# Altium schematic sheet Regulators.SchDoc
size A4; DocumentNumber: 7; SheetNumber: 7; SheetTotal: 10
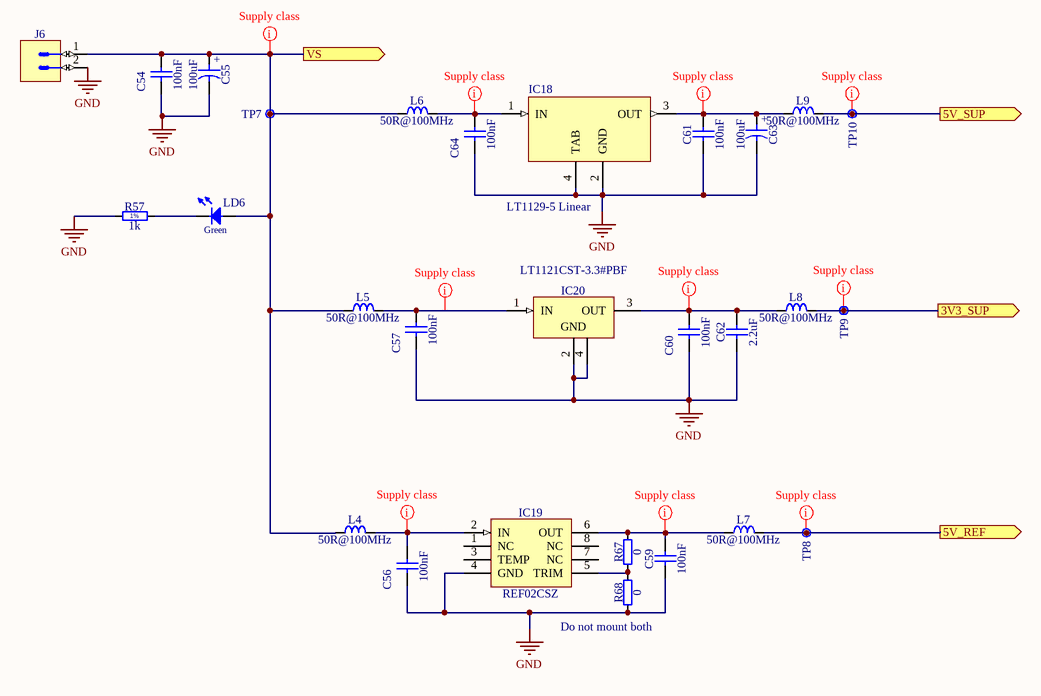
[diagram p0: Regulators.SchDoc]

## Parts
C54  100nF  [CAPC2012X135N]
C55  100uF  [CAPAE660X540N]
C56  100nF  [CAPC2012X135N]
C57  100nF  [CAPC2012X135N]
C59  100nF  [CAPC2012X135N]
C60  100nF  [CAPC2012X135N]
C61  100nF  [CAPC2012X135N]
C62  2.2uF  [CAPC2012X135N]
C63  100uF  [CAPAE660X540N]
C64  100nF  [CAPC2012X135N]
IC18  LT1129-5 Linear  [SOT230P700X175-4N]
IC19  REF02CSZ  [SOIC127P600X175-8N]
IC20  LT1121CST-3.3#PBF  [SOT230P700X180-4N]
J6  MATE-N-LOK  [TYCO_350786-1]  (value not drawn)
L4  50R@100MHz  [IND_MURATA_BLM31PG]
L5  50R@100MHz  [IND_MURATA_BLM31PG]
L6  50R@100MHz  [IND_MURATA_BLM31PG]
L7  50R@100MHz  [IND_MURATA_BLM31PG]
L8  50R@100MHz  [IND_MURATA_BLM31PG]
L9  50R@100MHz  [IND_MURATA_BLM31PG]
LD6  Green  [LED_OSRAM_LGR971]  (value not drawn)
R57  1k  [RESC2012X60N]
R67  0  [RESC2012X60N]
R68  0  [RESC2012X60N]
TP7  Test Point  [VERO_20-2136]  (value not drawn)
TP8  Test Point  [VERO_20-2136]  (value not drawn)
TP9  Test Point  [VERO_20-2136]  (value not drawn)
TP10  Test Point  [VERO_20-2136]  (value not drawn)

## Ports
3V3_SUP (out), 5V_REF (out), 5V_SUP (out), VS (out)

## Nets
GND: C54.1 C55.2 C56.1 C57.1 C59.1 C60.1 C61.1 C62.1 C63.2 C64.1 IC18.2(GND) IC18.4(TAB) IC19.4(GND) IC20.2(GND) IC20.4(GND) J6.2 R57.1 R68.1
3V3_SUP: L8.2 TP9.1 ; port 3V3_SUP
5V_REF: L7.2 TP8.1 ; port 5V_REF
5V_SUP: L9.2 TP10.1 ; port 5V_SUP
VS: C54.2 C55.1 J6.1 L4.1 L5.1 L6.1 LD6.2(A) TP7.1 ; port VS
NetC56_2: C56.2 IC19.2(IN) L4.2
NetC57_2: C57.2 IC20.1(IN) L5.2
NetC59_2: C59.2 IC19.6(OUT) L7.1 R67.2
NetC60_2: C60.2 C62.2 IC20.3(OUT) L8.1
NetC61_2: C61.2 C63.1 IC18.3(OUT) L9.1
NetC64_2: C64.2 IC18.1(IN) L6.2
NetIC19_5: IC19.5(TRIM) R67.1 R68.2
NetLD6_1: LD6.1(C) R57.2

Not connected (* = marked no-connect by the designer): IC19 1(NC) 3(TEMP) 7(NC) 8(NC)

## Layout directives
net class Supply: 3V3_SUP, 5V_REF, 5V_SUP, NetC56_2, NetC57_2, NetC59_2, NetC60_2, NetC61_2, NetC64_2, VS

## Notes on the sheet
- (near R68) Do not mount both
- (in symbol CAE660-540_100UF_16V_20%) +
- (in symbol R0805_1K_1%_0.125W_100PPM) 1%

## Library data of the parts
C54 C56 C57 C59-C61 C64 = CC0805_100NF_50V_10%_X7R: Non-polarised capacitor; Part Description: SMD Multilayer Chip Ceramic Capacitor; Manufacturer: GENERIC; Manufacturer1 Part Number: C2012X7R1H104K085AA; Voltage: 50V; TC: X7R; Tolerance: ±10%; Part Number: CC0805_100NF_50V_10%_X7R; Component Kind: Standard; Component Type: Standard; Pin Count: 2; Value: 100nF; Status: Preferred; Manufacturer Part Number: CC0805_100NF_50V_10%_X7R; Case: 0805; Mounted: Yes; Socket: No; SMD: Yes; Sense: No; Manufacturer1 Example: TDK; Manufacturer1 ComponentHeight: 1mm; HelpURL: \\cern.ch\dfs\Applications\Altium\Datasheets\CC0805_X7R_TDK_C.pdf; Author: CERN DEM JLC; CreateDate: 03.12.2007; LatestRevisionDate: 22.04.2015
C55 C63 = CAE660-540_100UF_16V_20%: Polarised capacitor; Part Description: Aluminum Electrolytic SMT Capacitor; Manufacturer: PANASONIC; Manufacturer Part Number: EEEFK1C101AP; Voltage: 16V; Tolerance: ±20%; Part Number: CAE660-540_100UF_16V_20%; Component Kind: Standard; Component Type: Standard; Pin Count: 2; Value: 100uF; Status: Not Recommended; Case: D; Mounted: Yes; Socket: No; SMD: Yes; Sense: No; ComponentHeight: 5.8mm; HelpURL: \\cern.ch\dfs\Applications\Altium\Datasheets\CAE_PANASONIC_FK.pdf; Author: CERN DEM JLC; CreateDate: 03.12.2007; LatestRevisionDate: 05.11.2014
C62 = CC0805_2.2UF_16V_10%_X7R: Non-polarised capacitor; Part Description: SMD Multilayer Chip Ceramic Capacitor; Manufacturer: GENERIC; Manufacturer1 Part Number: GRM21BF51C225ZA01L; Voltage: 16V; TC: X7R; Tolerance: ±10%; Part Number: CC0805_2.2UF_16V_10%_X7R; Component Kind: Standard; Component Type: Standard; Pin Count: 2; Value: 2.2uF; Status: Preferred; Manufacturer Part Number: CC0805_2.2UF_16V_10%_X7R; Case: 0805; Mounted: Yes; Socket: No; SMD: Yes; Sense: No; Manufacturer1 Example: MURATA; Manufacturer1 ComponentHeight: 1.5mm; HelpURL: \\cern.ch\dfs\Applications\Altium\Datasheets\CC0805_X7R_MURATA_GRM.pdf; Author: CERN DEM JLC; CreateDate: 03.12.2007; LatestRevisionDate: 18.09.2014
IC18 = LT1129-5: Name: LT1129-5; Manufacturer: Linear
IC19 = REF02CSZ: Precision Voltage Reference/Temperature Transducer; Part Description: 5V Precision Voltage Reference/Temperature Transducer; Manufacturer: ANALOG DEVICES; PressFit: No; Bonding: No; Part Number: REF02CSZ; Component Kind: Standard; Component Type: Standard; Device: REF02CSZ; PackageDescription: SOIC 8, Pitch 1.27mm, Body 4x5mm, IPC Medium Density; Manufacturer Part Number: REF02CSZ; Pin Count: 8; Case: SOIC8; Mounted: Yes; Socket: No; SMD: Yes; Sense: No; ComponentHeight: 1.75mm; HelpURL: \\cern.ch\dfs\Applications\Altium\Datasheets\REF02CSZ.pdf; Author: CERN DEM JLC; CreateDate: 29.05.2008; LatestRevisionDate: 29.05.2008
IC20 = LT1121CST-3.3#PBF: 3-Terminal Regulator 1=IN 2=GND 3=OUT 4=GND; Part Description: 3.3V, 150mA Micropower Low-Dropout Regulator; Manufacturer: LINEAR TECHNOLOGY; PressFit: No; Bonding: No; Part Number: LT1121CST-3.3#PBF; Component Kind: Standard; Component Type: Standard; Device: LT1121CST-3.3#PBF; PackageDescription: SOT223, 2.30mm pitch; 3 pin, 3.70mm W X 6.70mm L, IPC Medium Density; Manufacturer Part Number: LT1121CST-3.3#PBF; Pin Count: 4; Case: SOT223; Mounted: Yes; Socket: No; SMD: Yes; Sense: No; ComponentHeight: 1.8mm; HelpURL: \\cern.ch\dfs\Applications\Altium\Datasheets\LT1121CST-3.3#PBF.pdf; Author: CERN DEM JLC; CreateDate: 24.06.2014; LatestRevisionDate: 24.06.2014
J6 = TYCO_350786-1: Connector 2 Male; Part Description: 2 Circuits In-Line - Universal MATE-N-LOK Connector; Manufacturer: TYCO ELECTRONICS; PressFit: No; Part Number: TYCO_350786-1; Component Kind: Standard; Component Type: Standard; Pin Count: 2; Family: MATE-N-LOK; Mounted: Yes; Socket: No; SMD: No; Sense: No; Status: None; Manufacturer Part Number: 350786-1; ComponentHeight: 14.73mm; HelpURL: \\cern.ch\dfs\Applications\Altium\Datasheets\TYCO_350786-1.pdf; Author: CERN DEM JMW; CreateDate: 04.06.2008; LatestRevisionDate: 04.06.2008
L4-L9 = IND1206_MURATA_BLM31PG500SN1: Inductor; Part Description: SMD EMIFIL Chip Ferrite Bead; Manufacturer: MURATA; Power: 3.5A; Resistance: 0.015R; Part Number: IND1206_MURATA_BLM31PG500SN1; Component Kind: Standard; Component Type: Standard; Pin Count: 2; Value: 50R@100MHz; Status: None; Manufacturer Part Number: BLM31PG500SN1; Case: 1206; Mounted: Yes; Socket: No; SMD: Yes; Sense: No; ComponentHeight: 1.3mm; HelpURL: \\cern.ch\dfs\Applications\Altium\Datasheets\IND1206_MURATA_BLM31P.pdf; Author: CERN DEM JLC; CreateDate: 05.12.2013; LatestRevisionDate: 05.12.2013
LD6 = LED_OSRAM_LGR971: LED Green 1C 2A; Part Description: Surface Mount Green LED (0805 Case); Manufacturer: OSRAM; Manufacturer Part Number: LGR971; PressFit: No; Bonding: No; Part Number: LED_OSRAM_LGR971; Component Kind: Standard; Component Type: Standard; Color: Green; PackageDescription: Green Chip LED, 2-Leads, Body 2.0x1.25mm, IPC Medium Density; Pin Count: 2; Case: 0805; Mounted: Yes; Socket: No; SMD: Yes; Sense: No; ComponentHeight: 0.9mm; HelpURL: \\cern.ch\dfs\Applications\Altium\Datasheets\LED_OSRAM_LGR971.pdf; Author: CERN DEM JLC; CreateDate: 28.01.2009; LatestRevisionDate: 17.03.2010
R57 = R0805_1K_1%_0.125W_100PPM: Resistor - 1%; Part Description: General Purpose Thick Film Chip Resistor; Manufacturer: GENERIC; Manufacturer1 Part Number: NRC10F1001TRF; Power: 0.125W; TC: ±100ppm/°C; PressFit: No; Part Number: R0805_1K_1%_0.125W_100PPM; Component Kind: Standard; Component Type: Standard; Pin Count: 2; Value: 1k; Status: Preferred; Tolerance: ±1%; Manufacturer Part Number: R0805_1K_1%_0.125W_100PPM; Case: 0805; Mounted: Yes; Sense: No; Socket: No; SMD: Yes; Manufacturer1 Example: NIC COMPONENT; Manufacturer1 ComponentHeight: 0.6mm; HelpURL: \\cern.ch\dfs\Applications\Altium\Datasheets\R0805_NIC_NRC.pdf; Author: CERN DEM JLC; CreateDate: 03.12.2007; LatestRevisionDate: 13.03.2008
R67 R68 = R0805_0R_JUMPER: Resistor; Part Description: 2A (0.05R Max DC Resistance) Zero Ohm Jumper; Manufacturer: GENERIC; Manufacturer1 Part Number: NRC10Z0; PressFit: No; Part Number: R0805_0R_JUMPER; Component Kind: Standard; Component Type: Standard; Pin Count: 2; Value: 0; Status: Preferred; Manufacturer Part Number: R0805_0R_JUMPER; Case: 0805; Mounted: Yes; Sense: No; Socket: No; SMD: Yes; Manufacturer1 Example: NIC COMPONENT; Manufacturer1 ComponentHeight: 0.6mm; HelpURL: \\cern.ch\dfs\Applications\Altium\Datasheets\R0805_NIC_NRC.pdf; Author: CERN DEM JLC; CreateDate: 03.12.2007; LatestRevisionDate: 13.03.2008
TP7-TP10 = VERO_20-2136: Part Description: Black Bead PCB Terminal Test Pin for 1.6mm PCB Thickness (1.32mm Hole); Manufacturer: VERO TECHNOLOGIES; PressFit: No; Part Number: VERO_20-2136; Component Kind: Standard; Component Type: Standard; Pin Count: 1; Family: Test Point; Mounted: Yes; Socket: No; SMD: No; Sense: No; Status: None; Manufacturer Part Number: 20-2136; ComponentHeight: 5.3mm; HelpURL: \\cern.ch\dfs\Applications\Altium\Datasheets\VERO_20-2136.pdf; Author: CERN DEM JLC; CreateDate: 21.07.2008; LatestRevisionDate: 15.07.2013